# EAGLE design M202B (EAGLE 6.6.0)
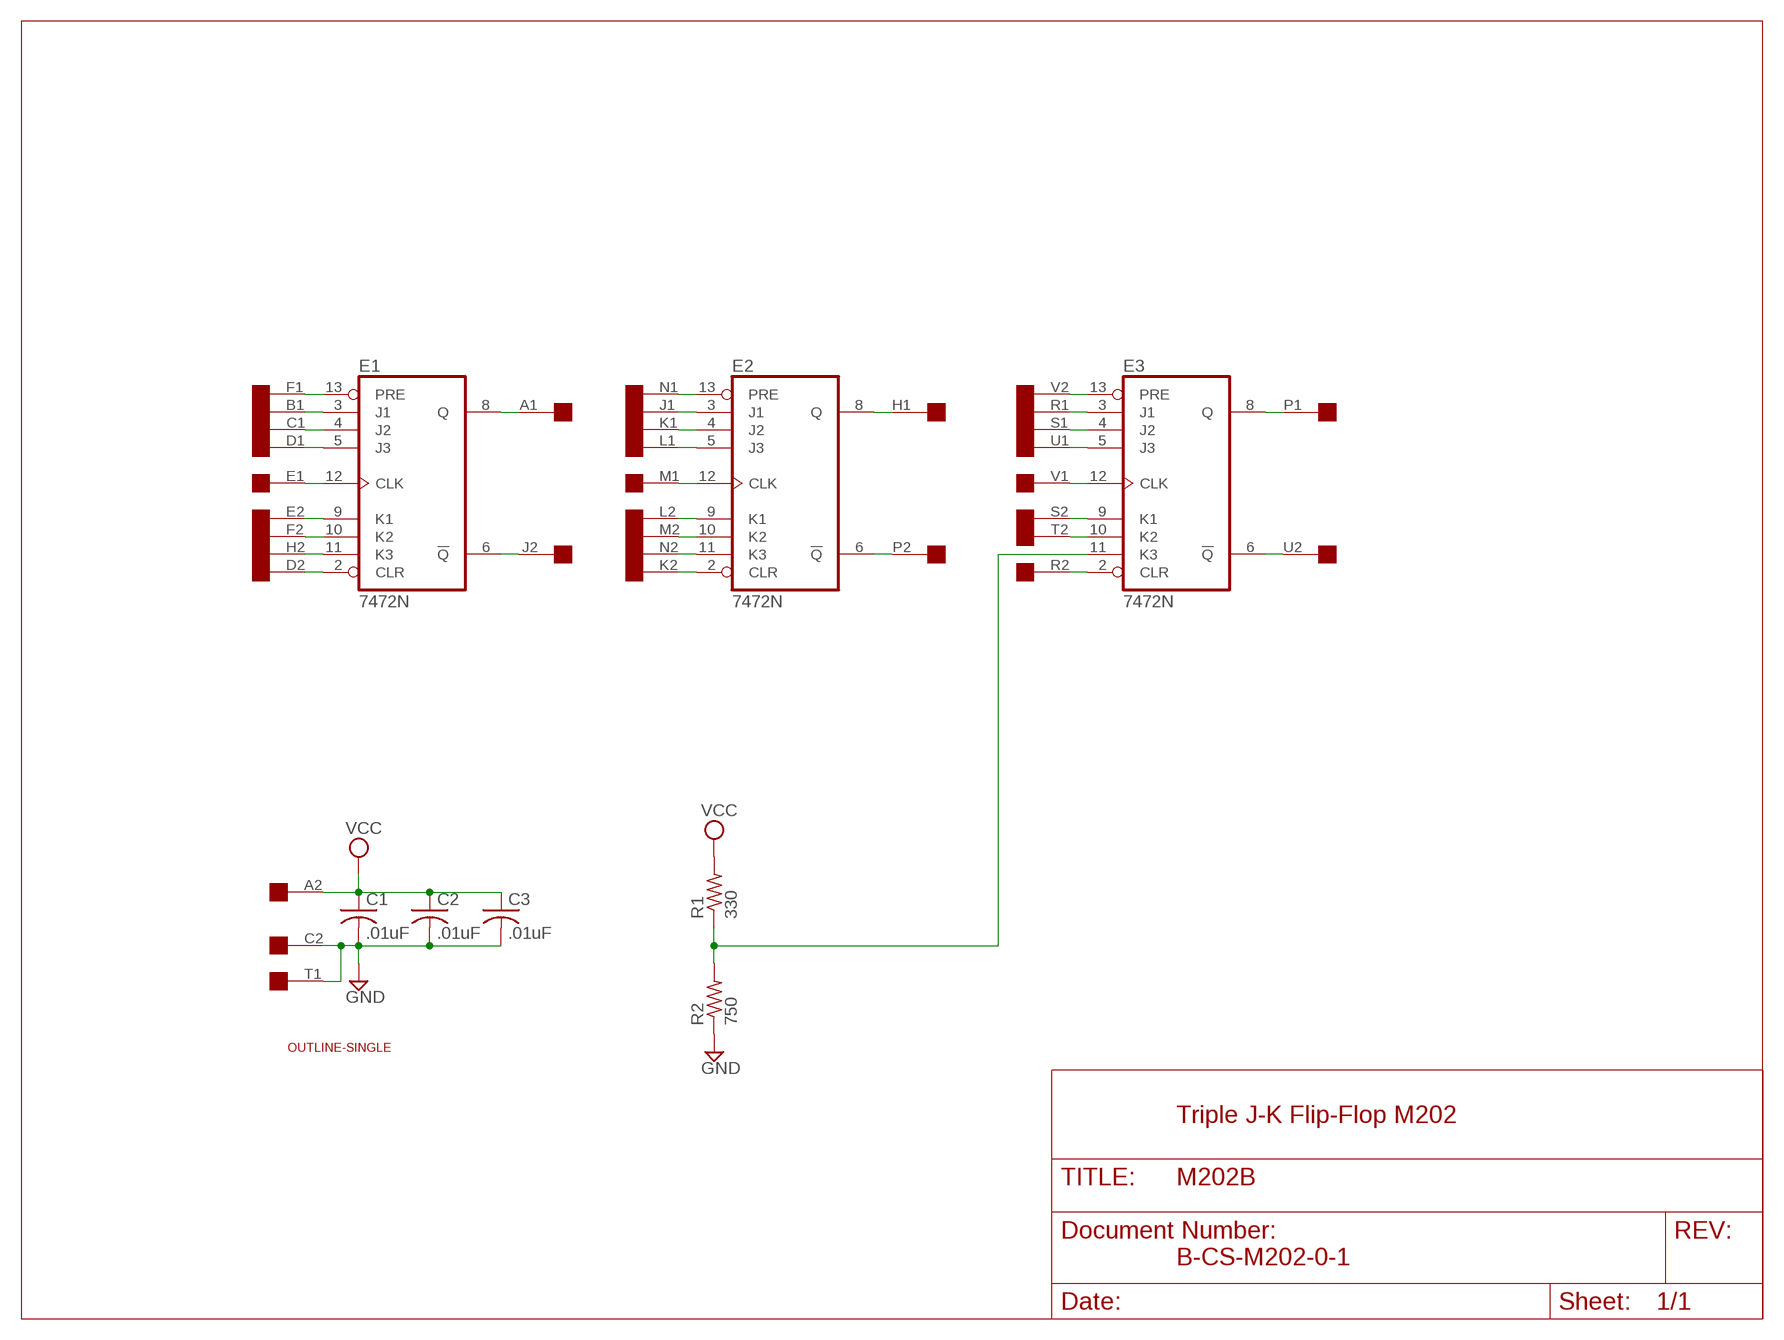
[diagram p0: schematic, sheet 1]

## Parts
C1  .01uF  C-US050-025X075  [C050-025X075]
C2  .01uF  C-US050-025X075  [C050-025X075]
C3  .01uF  C-US050-025X075  [C050-025X075]
E1  7472N  [DIL14]
E2  7472N  [DIL14]
E3  7472N  [DIL14]
R1  330  R-US_0207/10  [0207/10]
R2  750  R-US_0207/10  [0207/10]
U$1  OUTLINE-SINGLE  [SINGLE]
U$2  SINGLE  [EDGE-CON2]

## Nets
A1: E1.8(Q) U$2.A1
B1: E1.3(J1) U$2.B1
C1: E1.4(J2) U$2.C1
D1: E1.5(J3) U$2.D1
D2: E1.2(CLR) U$2.D2
E1: E1.12(CLK) U$2.E1
E2: E1.9(K1) U$2.E2
F1: E1.13(PRE) U$2.F1
F2: E1.10(K2) U$2.F2
GND: C1.2 C2.2 C3.2 R2.1 U$2.C2 U$2.T1
H1: E2.8(Q) U$2.H1
H2: E1.11(K3) U$2.H2
J1: E2.3(J1) U$2.J1
J2: E1.6(!Q) U$2.J2
K1: E2.4(J2) U$2.K1
K2: E2.2(CLR) U$2.K2
L1: E2.5(J3) U$2.L1
L2: E2.9(K1) U$2.L2
M1: E2.12(CLK) U$2.M1
M2: E2.10(K2) U$2.M2
N1: E2.13(PRE) U$2.N1
N2: E2.11(K3) U$2.N2
N$26: E3.11(K3) R1.1 R2.2
P1: E3.8(Q) U$2.P1
P2: E2.6(!Q) U$2.P2
R1: E3.3(J1) U$2.R1
R2: E3.2(CLR) U$2.R2
S1: E3.4(J2) U$2.S1
S2: E3.9(K1) U$2.S2
T2: E3.10(K2) U$2.T2
U1: E3.5(J3) U$2.U1
U2: E3.6(!Q) U$2.U2
V1: E3.12(CLK) U$2.V1
V2: E3.13(PRE) U$2.V2
VCC: C1.1 C2.1 C3.1 R1.2 U$2.A2
Unconnected: U$2.B2

## Notes on the sheet
- Triple J-K Flip-Flop M202
- B-CS-M202-0-1

## Power pins joined to a net without a drawn wire
GND: E1.7(GND) E2.7(GND) E3.7(GND)
VCC: E1.14(VCC) E2.14(VCC) E3.14(VCC)

## Library data of the parts
C1-C3 = rcl:C-US: CAPACITOR, American symbol
E1-E3 = 74xx-us:74*72: AND gated J-K master slave FLIP FLOP, preset and clear
R1 R2 = rcl:R-US_: RESISTOR, American symbol
U$1 = dec-con:OUTLINE-*: Board outlines for DEC boards.
U$2 = dec-con:SINGLE: Single-Height DEC board

## Net classes
0 default: width 0.813 mm

## Board
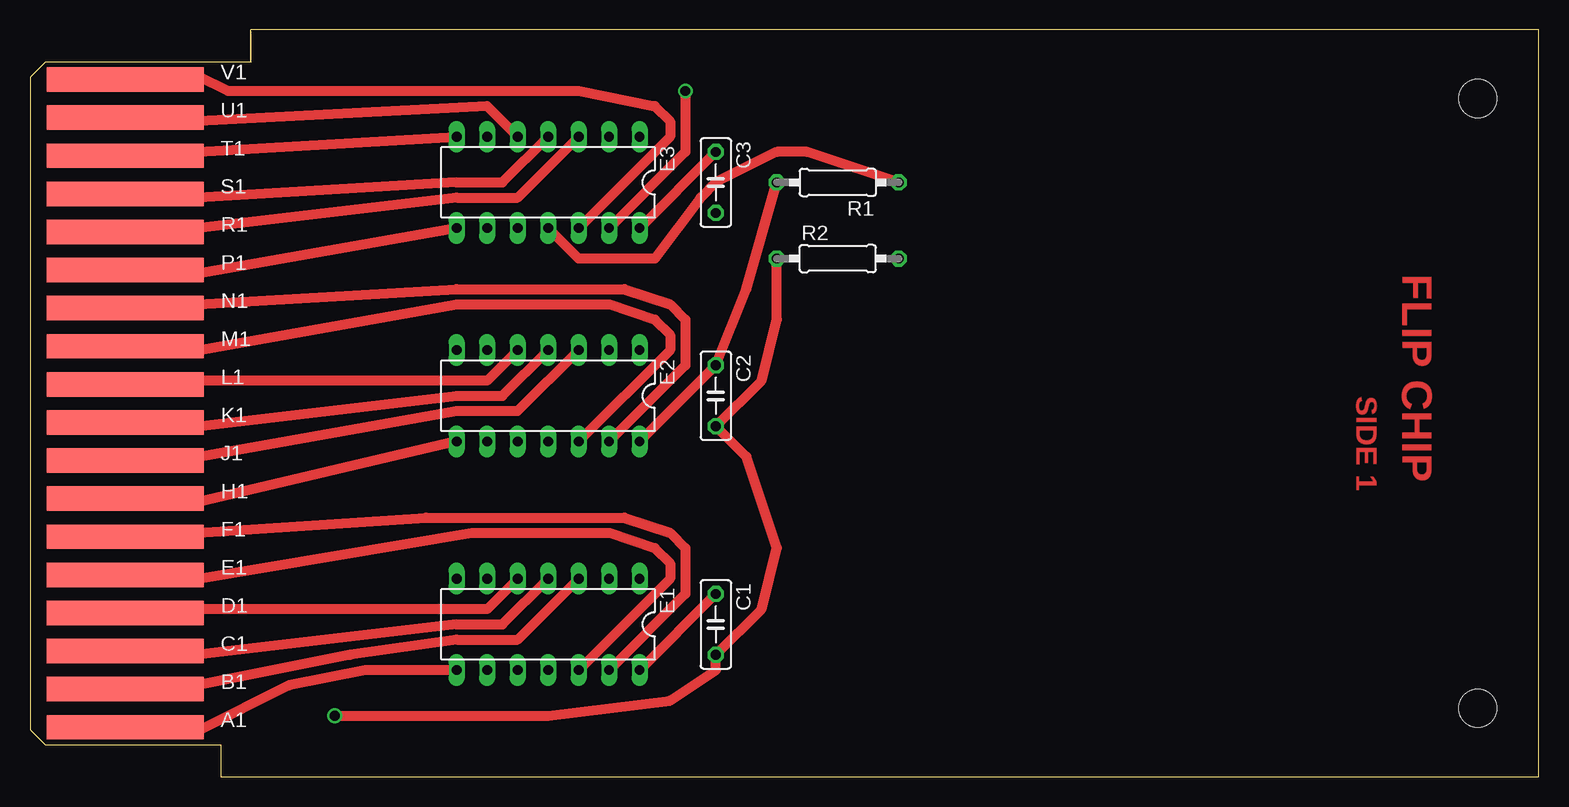
[diagram p1: board, top side]
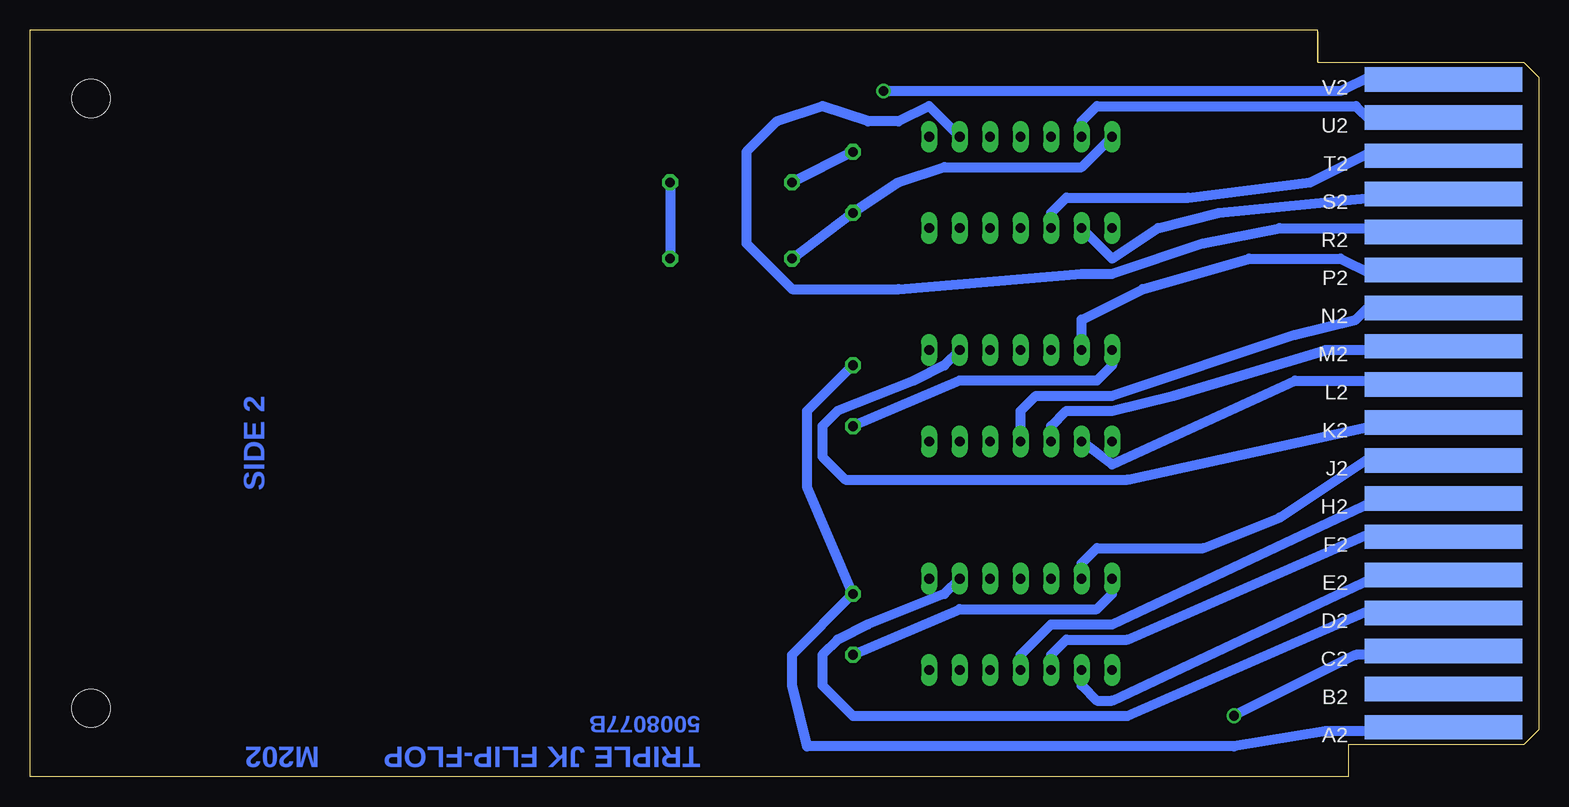
[diagram p2: board, bottom side, seen from below]

Size 125.73 x 62.23 mm. Coordinates in mm from the lower left corner, seen from the top.
Copper layers (1+16): Top 0.035mm / dielectric 1.5mm / Bottom 0.035mm
Design rules "16mils": minimum track width 16mil, minimum drill 32mil, track to track 15mil, track to pad 10mil, pad to pad 10mil, via to via 10mil, smd to smd 10mil, copper to edge 13mil, drill to drill 10mil, minimum pad ring 10mil, minimum via ring 8mil, stop-mask expansion 0mil, vias tented up to drill 0mil, thermal gap 10mil

### Footprints (pad centres in the part's own frame; a part is rotated, then mirrored left to right if it is on the bottom)
C050-025X075 = drill 0.813 octagon: 1 -2.54,0; 2 2.54,0
DIL14 = drill 0.813 long: 1 -7.62,-3.81; 2 -5.08,-3.81; 3 -2.54,-3.81; 4 0,-3.81; 5 2.54,-3.81; 6 5.08,-3.81; 7 7.62,-3.81; 8 7.62,3.81; 9 5.08,3.81; 10 2.54,3.81; 11 0,3.81; 12 -2.54,3.81; 13 -5.08,3.81; 14 -7.62,3.81
0207/10 = drill 0.813 octagon: 1 -5.08,0; 2 5.08,0
SINGLE = hole 3.175: 120.65,56.515; 120.65,5.715
EDGE-CON2 = smd 13.106 x 2.032: A1 7.938,4.128; B1 7.938,7.303; C1 7.938,10.477; D1 7.938,13.652; E1 7.938,16.828; F1 7.938,20.003; H1 7.938,23.177; J1 7.938,26.352; K1 7.938,29.527; L1 7.938,32.703; M1 7.938,35.877; N1 7.938,39.053; P1 7.938,42.227; R1 7.938,45.403; S1 7.938,48.578; T1 7.938,51.752; U1 7.938,54.928; V1 7.938,58.102 | smd 13.106 x 2.032 bottom: A2 7.938,4.128; B2 7.938,7.303; C2 7.938,10.477; D2 7.938,13.652; E2 7.938,16.828; F2 7.938,20.003; H2 7.938,23.177; J2 7.938,26.352; K2 7.938,29.527; L2 7.938,32.703; M2 7.938,35.877; N2 7.938,39.053; P2 7.938,42.227; R2 7.938,45.403; S2 7.938,48.578; T2 7.938,51.752; U2 7.938,54.928; V2 7.938,58.102

### Placement (x,y rotation side)
C1  57.15,12.7 270 top
C2  57.15,31.75 270 top
C3  57.15,49.53 270 top
E1  43.18,12.7 180 top
E2  43.18,31.75 180 top
E3  43.18,49.53 180 top
R1  67.31,49.53 180 top
R2  67.31,43.18 0 top
U$1  0,0 0 top
U$2  0,0 0 top

### Tracks (layer width: path | path; a pad name or v marks a point on that pad's centre or on a via)
A1
  Top 0.813: E1.8 27.94,8.89 21.59,7.62 13.97,3.81 8.89,3.81 U$2.A1
B1
  Top 0.813: U$2.B1 8.89,7.62 13.97,7.62 26.67,10.16 35.56,11.43 40.64,11.43 E1.3
C1
  Top 0.813: U$2.C1 8.89,10.16 13.97,10.16 35.56,12.7 39.37,12.7 E1.4
D1
  Top 0.813: U$2.D1 8.89,13.97 38.1,13.97 E1.5
D2
  Bottom 0.813: E1.2 49.53,15.24 55.88,12.7 58.42,11.43 59.69,10.16 59.69,7.62 57.15,5.08 34.29,5.08 13.97,13.97 8.89,13.97 U$2.D2
E1
  Top 0.813: U$2.E1 8.89,16.51 13.97,16.51 36.83,20.32 48.26,20.32 52.07,19.05 53.34,17.78 53.34,16.51 E1.12
E2
  Bottom 0.813: E1.9 38.1,7.62 36.83,6.35 35.56,6.35 13.97,16.51 8.89,16.51 U$2.E2
F1
  Top 0.813: U$2.F1 8.89,20.32 13.97,20.32 33.02,21.59 49.53,21.59 53.34,20.32 54.61,19.05 54.61,15.24 E1.13
F2
  Bottom 0.813: E1.10 40.64,10.16 39.37,11.43 34.29,11.43 13.97,20.32 8.89,20.32 U$2.F2
GND  (via drill 0.81)
  Top 0.813: v25.4,5.08 43.18,5.08 53.34,6.35 57.15,8.89 C1.2 60.96,13.97 62.23,19.05 59.69,26.67 C2.2 60.96,33.02 62.23,38.1 R2.1 | U$2.T1 13.97,52.07 E3.7
  Bottom 0.813: U$2.C2 8.89,10.16 15.24,10.16 v25.4,5.08 | C1.2 48.26,13.97 36.83,13.97 35.56,15.24 E1.7 | E2.7 35.56,34.29 36.83,33.02 48.26,33.02 C2.2 | R2.1 C3.2 53.34,49.53 49.53,50.8 38.1,50.8 E3.7
H1
  Top 0.813: E2.8 13.97,22.86 8.89,22.86 U$2.H1
H2
  Bottom 0.813: E1.11 43.18,10.16 40.64,12.7 35.56,12.7 13.97,22.86 8.89,22.86 U$2.H2
J1
  Top 0.813: U$2.J1 8.89,26.67 13.97,26.67 35.56,30.48 40.64,30.48 E2.3
J2
  Bottom 0.813: E1.6 38.1,17.78 36.83,19.05 27.94,19.05 21.59,21.59 13.97,26.67 8.89,26.67 U$2.J2
K1
  Top 0.813: U$2.K1 8.89,29.21 13.97,29.21 35.56,31.75 39.37,31.75 E2.4
K2
  Bottom 0.813: E2.2 49.53,34.29 52.07,33.02 58.42,30.48 59.69,29.21 59.69,26.67 57.79,24.77 34.29,24.77 13.97,29.21 8.89,29.21 U$2.K2
L1
  Top 0.813: U$2.L1 8.89,33.02 38.1,33.02 E2.5
L2
  Bottom 0.813: E2.9 35.56,26.04 20.32,33.02 8.89,33.02 U$2.L2
M1
  Top 0.813: E2.12 53.34,35.56 53.34,36.83 52.07,38.1 48.26,39.37 35.56,39.37 13.97,35.56 8.89,35.56 U$2.M1
M2
  Bottom 0.813: E2.10 40.64,29.21 39.37,30.48 35.56,30.48 30.48,31.75 17.78,35.56 8.89,35.56 U$2.M2
N1
  Top 0.813: E2.13 54.61,34.29 54.61,38.1 53.34,39.37 49.53,40.64 35.56,40.64 13.97,39.37 8.89,39.37 U$2.N1
N2
  Bottom 0.813: E2.11 43.18,30.48 41.91,31.75 35.56,31.75 20.32,36.83 15.24,38.1 13.97,39.37 8.89,39.37 U$2.N2
N$26
  Top 0.813: R1.1 64.77,52.07 62.23,52.07 57.15,49.53 55.88,48.26 52.07,43.18 45.72,43.18 E3.11
  Bottom 0.813: R1.1 R2.2
P1
  Top 0.813: E3.8 13.97,41.91 8.89,41.91 U$2.P1
P2
  Bottom 0.813: E2.6 38.1,38.1 33.02,40.64 24.13,43.18 16.51,43.18 13.97,41.91 8.89,41.91 U$2.P2
R1
  Top 0.813: U$2.R1 8.89,45.72 13.97,45.72 35.56,48.26 40.64,48.26 E3.3
R2
  Bottom 0.813: E3.2 50.8,55.88 53.34,54.61 55.88,54.61 59.69,55.88 63.5,54.61 66.04,52.07 66.04,44.45 62.23,40.64 53.34,40.64 38.1,41.91 35.56,41.91 27.94,44.45 21.59,45.72 8.89,45.72 U$2.R2
S1
  Top 0.813: U$2.S1 8.89,48.26 13.97,48.26 35.56,49.53 39.37,49.53 E3.4
S2
  Bottom 0.813: E3.9 35.56,43.18 31.75,45.72 26.67,46.99 13.97,48.26 8.89,48.26 U$2.S2
T2
  Bottom 0.813: E3.10 40.64,46.99 39.37,48.26 29.21,48.26 19.05,49.53 13.97,52.07 8.89,52.07 U$2.T2
U1
  Top 0.813: E3.5 38.1,55.88 13.97,54.61 8.89,54.61 U$2.U1
U2
  Bottom 0.813: E3.6 38.1,54.61 36.83,55.88 15.24,55.88 13.97,54.61 8.89,54.61 U$2.U2
V1
  Top 0.813: E3.12 53.34,53.34 53.34,54.61 52.07,55.88 45.72,57.15 16.51,57.15 13.97,58.42 8.89,58.42 U$2.V1
V2  (via drill 0.81)
  Top 0.813: v54.61,57.15 54.61,52.07 E3.13
  Bottom 0.813: v54.61,57.15 16.51,57.15 13.97,58.42 8.89,58.42 U$2.V2
VCC
  Top 0.813: E3.14 C3.1 | E2.14 C2.1 59.69,40.64 R1.2 | E1.14 C1.1
  Bottom 0.813: U$2.A2 8.89,4.13 8.89,3.81 17.78,3.81 25.4,2.54 60.96,2.54 62.23,7.62 62.23,10.16 C1.1 60.96,24.13 60.96,30.48 C2.1 | C3.1 R1.2

### Text on the board
Top: FLIP CHIP | SIDE 1
Bottom: SIDE 2 | 5008077B | TRIPLE JK FLIP-FLOP | M202
201bmp: FLIP CHIP | SIDE 1